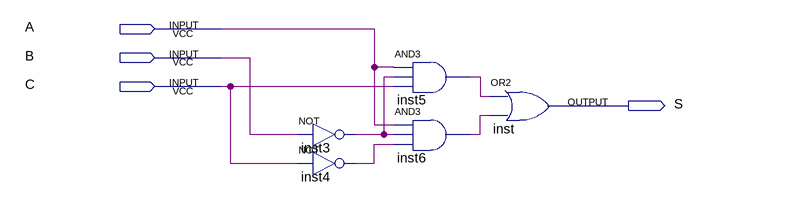
[diagram p0: schematic sheet]
// Quartus schematic circ_1.bdf as structural Verilog: 5 symbols, 4 pins
module circ_1 (
  input  A,
  input  B,
  input  C,
  output S
);

  wire inst3_out, inst4_out, inst5_out, inst6_out;

  not inst3 (inst3_out, B);
  not inst4 (inst4_out, C);
  and inst5 (inst5_out, A, inst3_out, C);
  and inst6 (inst6_out, A, inst3_out, inst4_out);
  or inst (S, inst5_out, inst6_out);
endmodule
